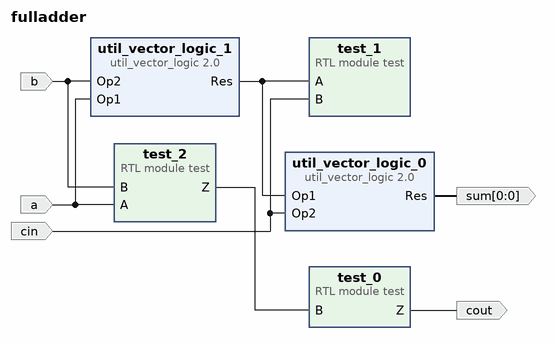
[diagram p0: block diagram of the top level]
# Vivado block design fulladder, xc7a35ticpg236-1L, Vivado 2019.2
create_bd_design fulladder

create_bd_port -dir O -from 0 -to 0 sum
create_bd_port -dir O cout
create_bd_port -dir I a
create_bd_port -dir I cin
create_bd_port -dir I b

create_bd_cell -type ip -vlnv xilinx.com:ip:util_vector_logic:2.0 util_vector_logic_0
set_property -dict {CONFIG.C_OPERATION xor CONFIG.C_SIZE 1} [get_bd_cells util_vector_logic_0]
create_bd_cell -type ip -vlnv xilinx.com:ip:util_vector_logic:2.0 util_vector_logic_1
set_property -dict {CONFIG.C_OPERATION xor CONFIG.C_SIZE 1} [get_bd_cells util_vector_logic_1]
create_bd_cell -type module -reference test test_0
create_bd_cell -type module -reference test test_1
create_bd_cell -type module -reference test test_2

# ---- connections ----

connect_bd_net [get_bd_pins util_vector_logic_1/Res] [get_bd_pins util_vector_logic_0/Op1] [get_bd_pins test_1/A]
connect_bd_net [get_bd_pins test_2/Z] [get_bd_pins test_0/B]
connect_bd_net [get_bd_ports b] [get_bd_pins test_2/B] [get_bd_pins util_vector_logic_1/Op2]
connect_bd_net [get_bd_ports a] [get_bd_pins test_2/A] [get_bd_pins util_vector_logic_1/Op1]
connect_bd_net [get_bd_pins util_vector_logic_0/Res] [get_bd_ports sum]
connect_bd_net [get_bd_pins test_0/Z] [get_bd_ports cout]
connect_bd_net [get_bd_ports cin] [get_bd_pins test_1/B] [get_bd_pins util_vector_logic_0/Op2]

validate_bd_design
save_bd_design
